# Altium schematic sheet 0111_AUDIO - COMBO JACK.SchDoc
size 848 x 558 mm
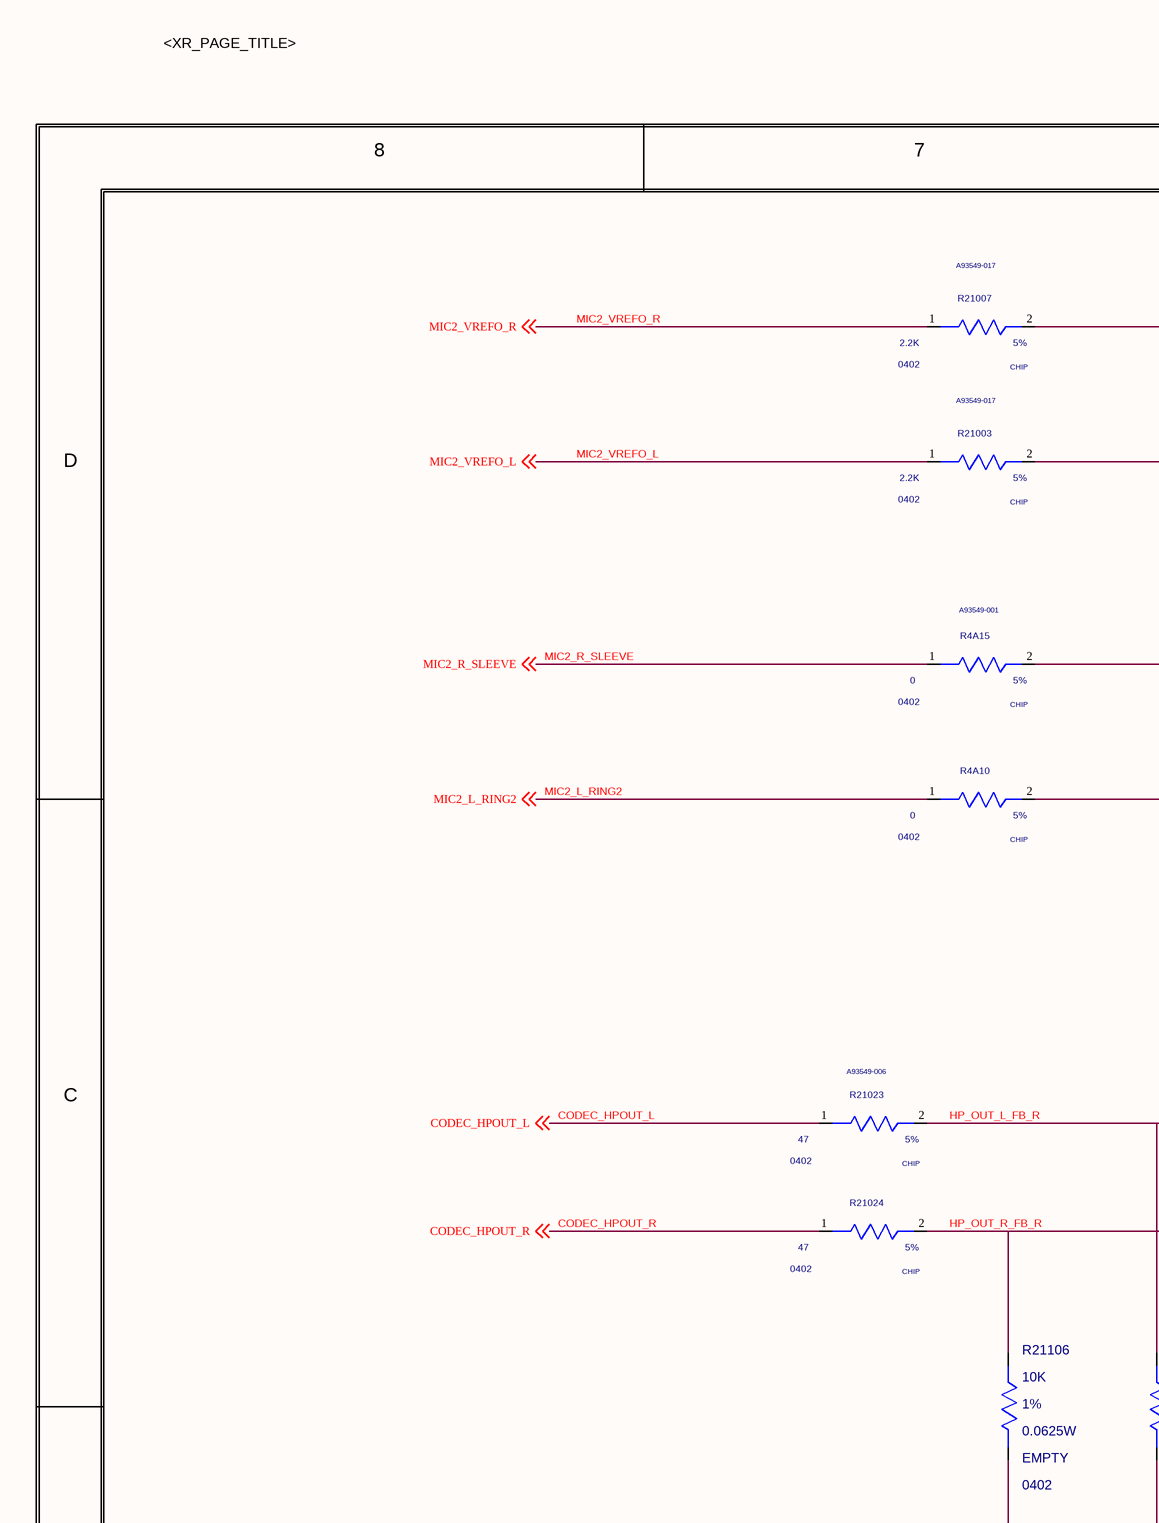
[diagram p0: 0111_AUDIO - COMBO JACK.SchDoc, top left]
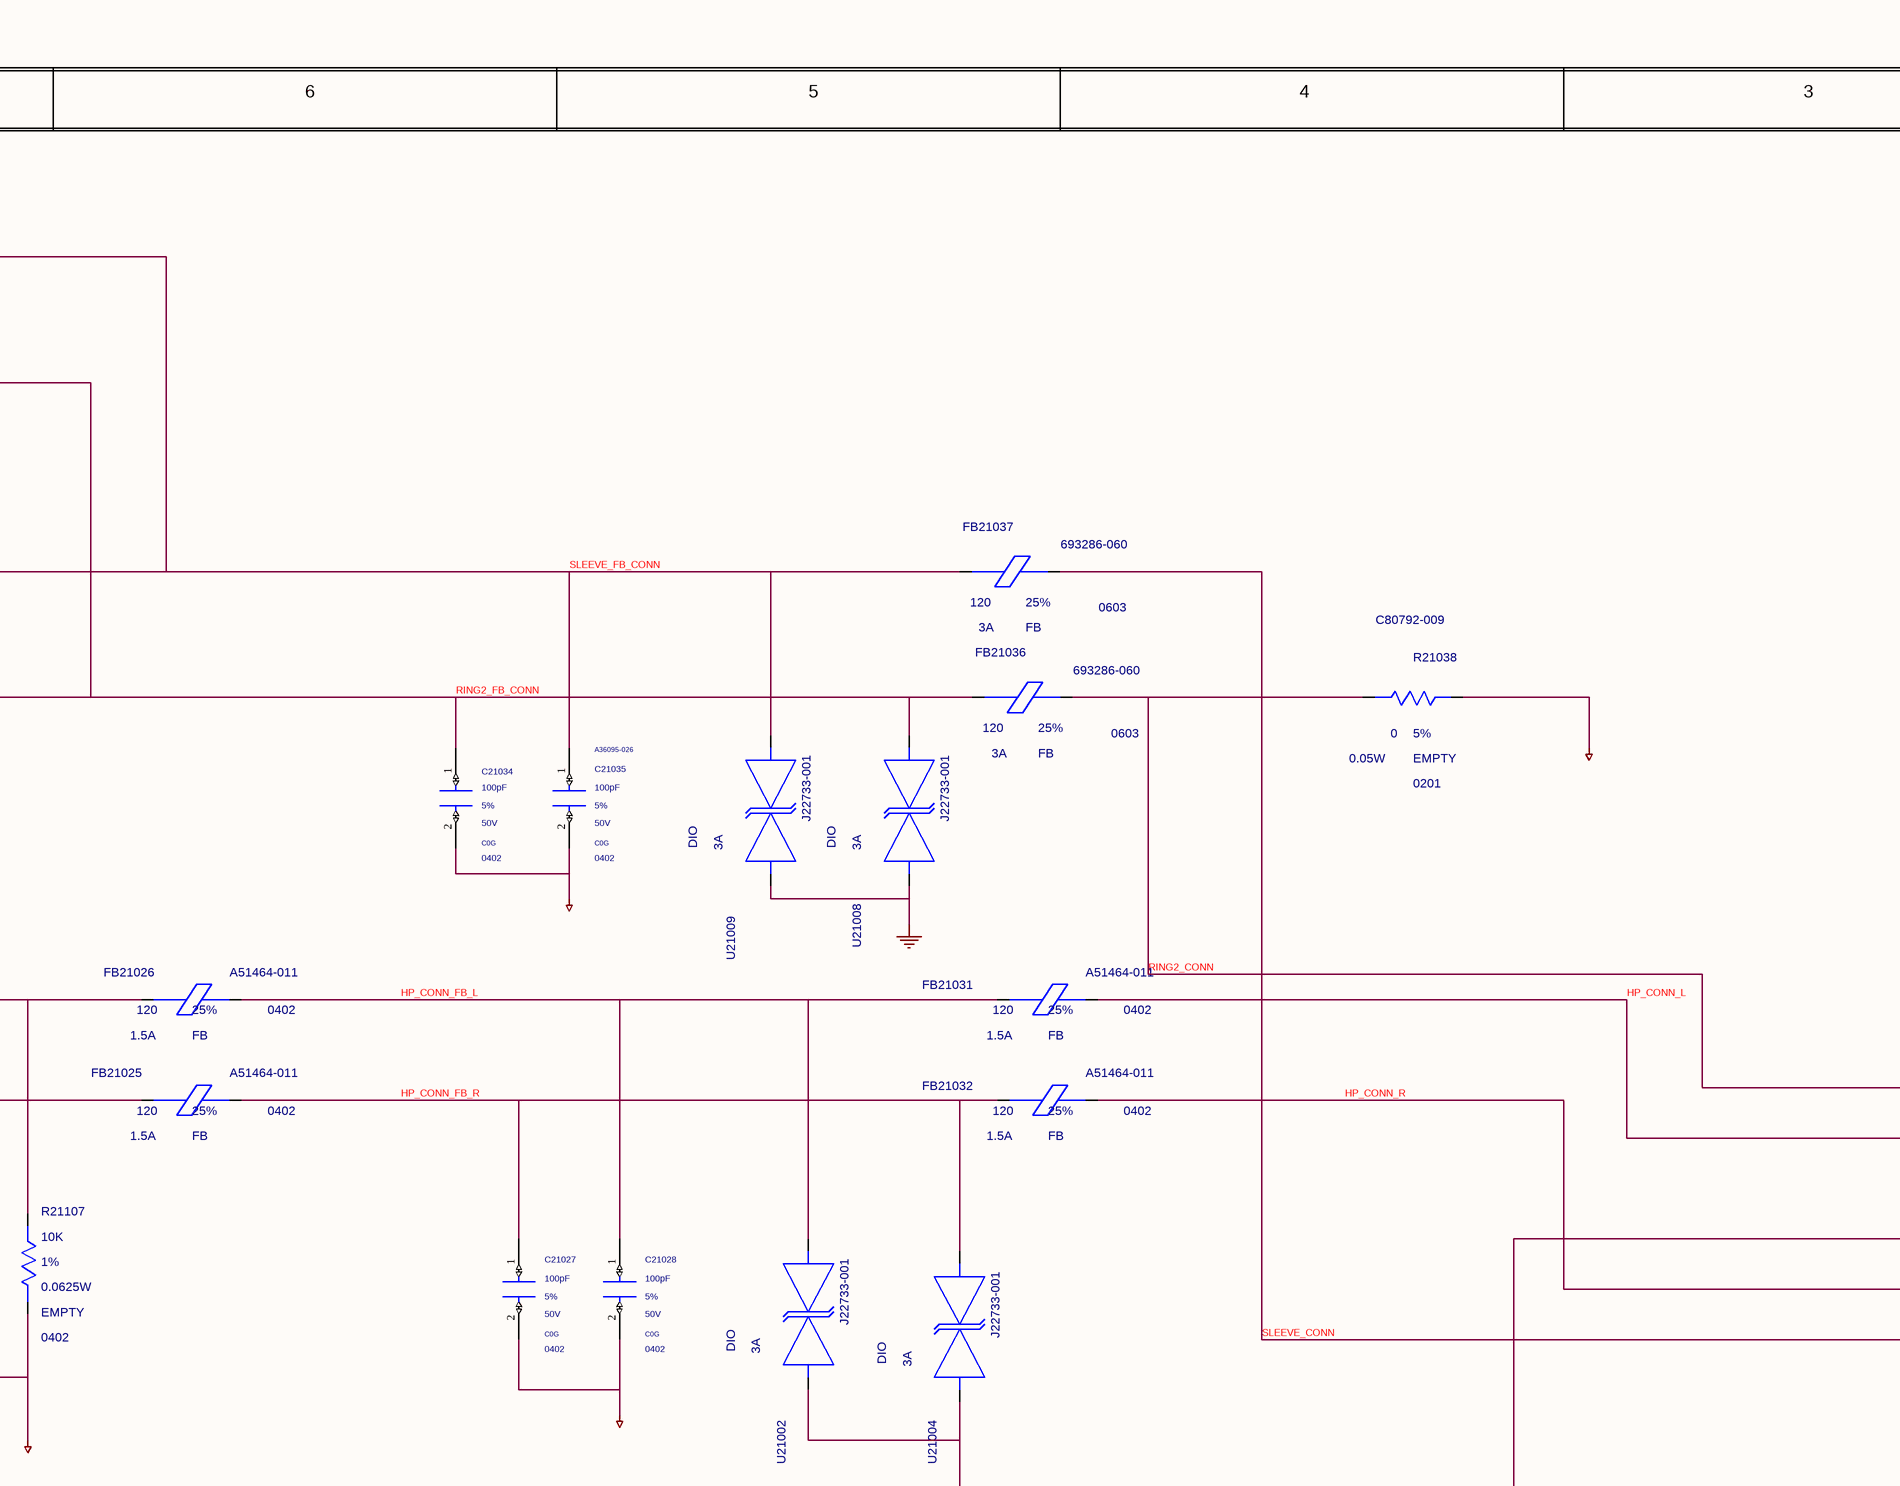
[diagram p1: 0111_AUDIO - COMBO JACK.SchDoc, top middle]
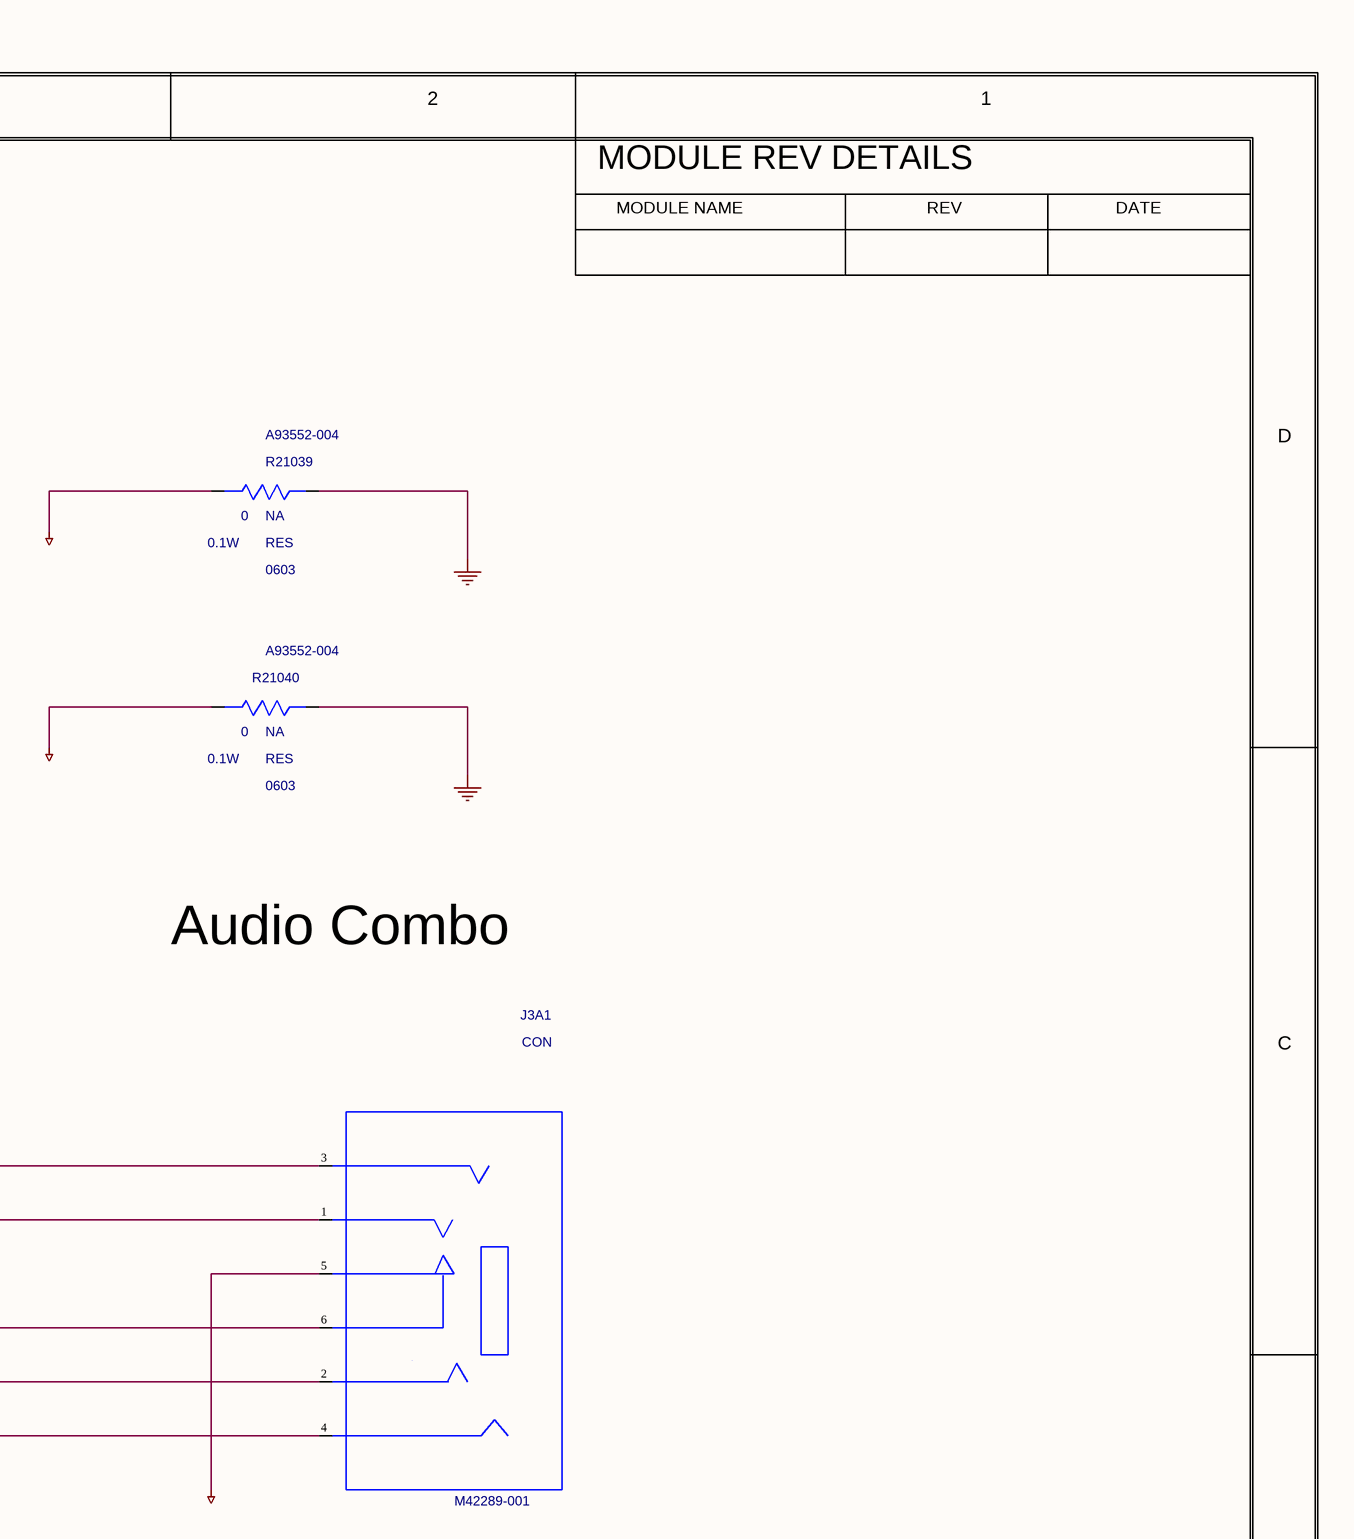
[diagram p2: 0111_AUDIO - COMBO JACK.SchDoc, top right]
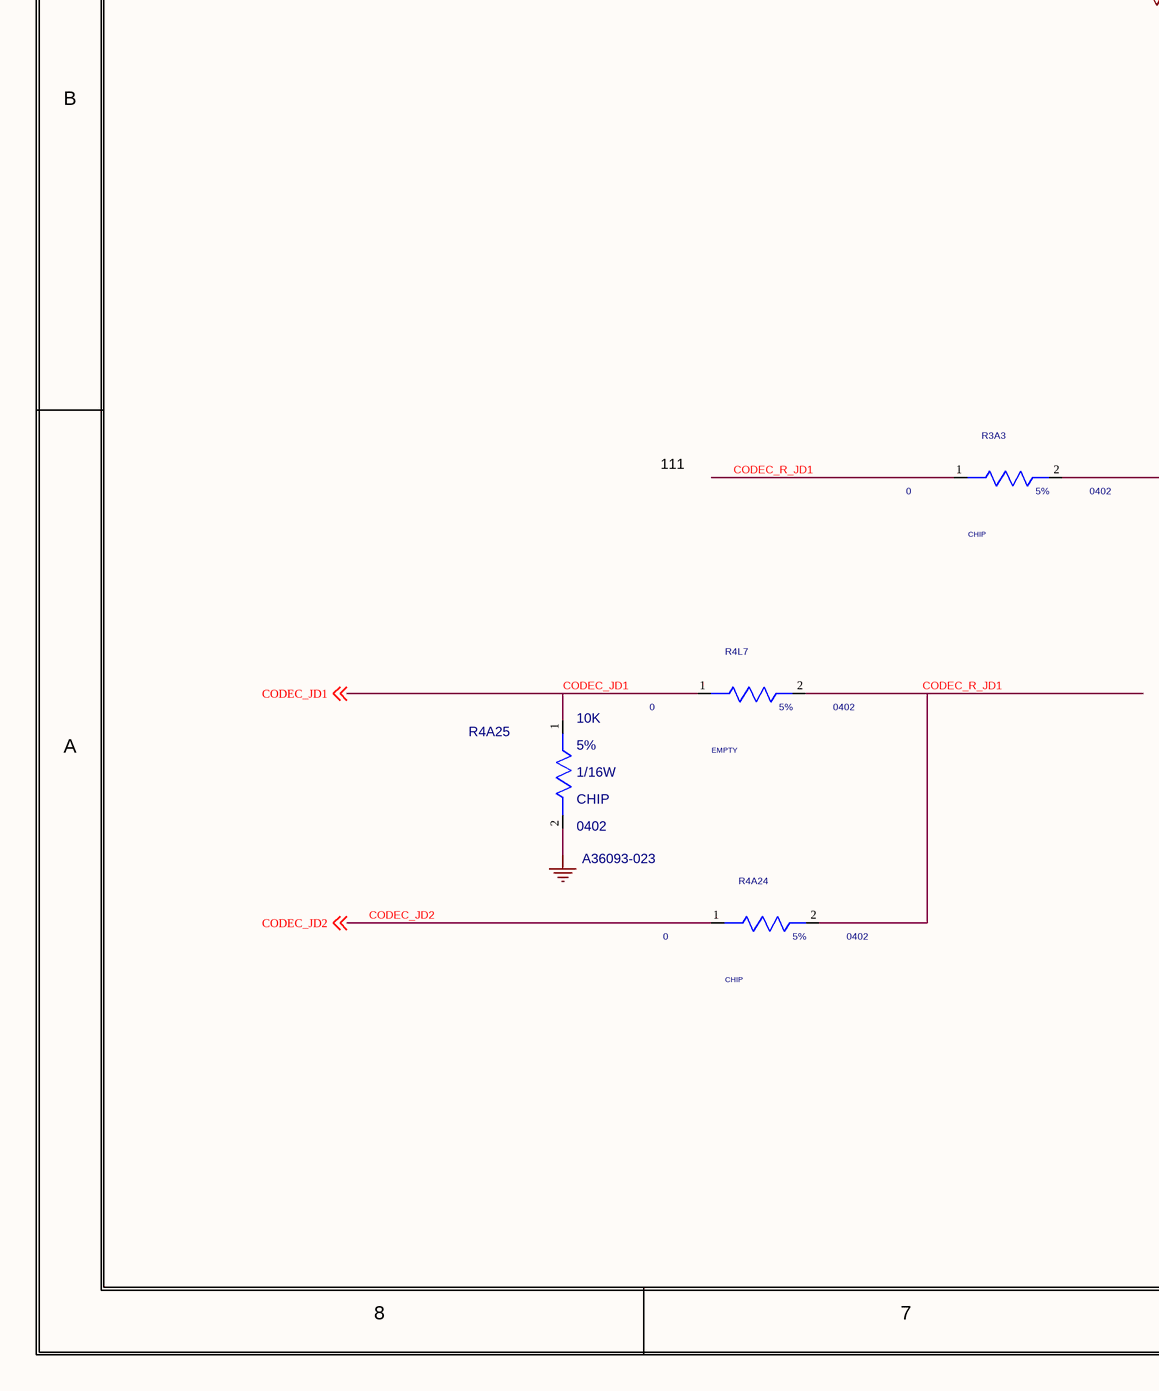
[diagram p3: 0111_AUDIO - COMBO JACK.SchDoc, bottom left]
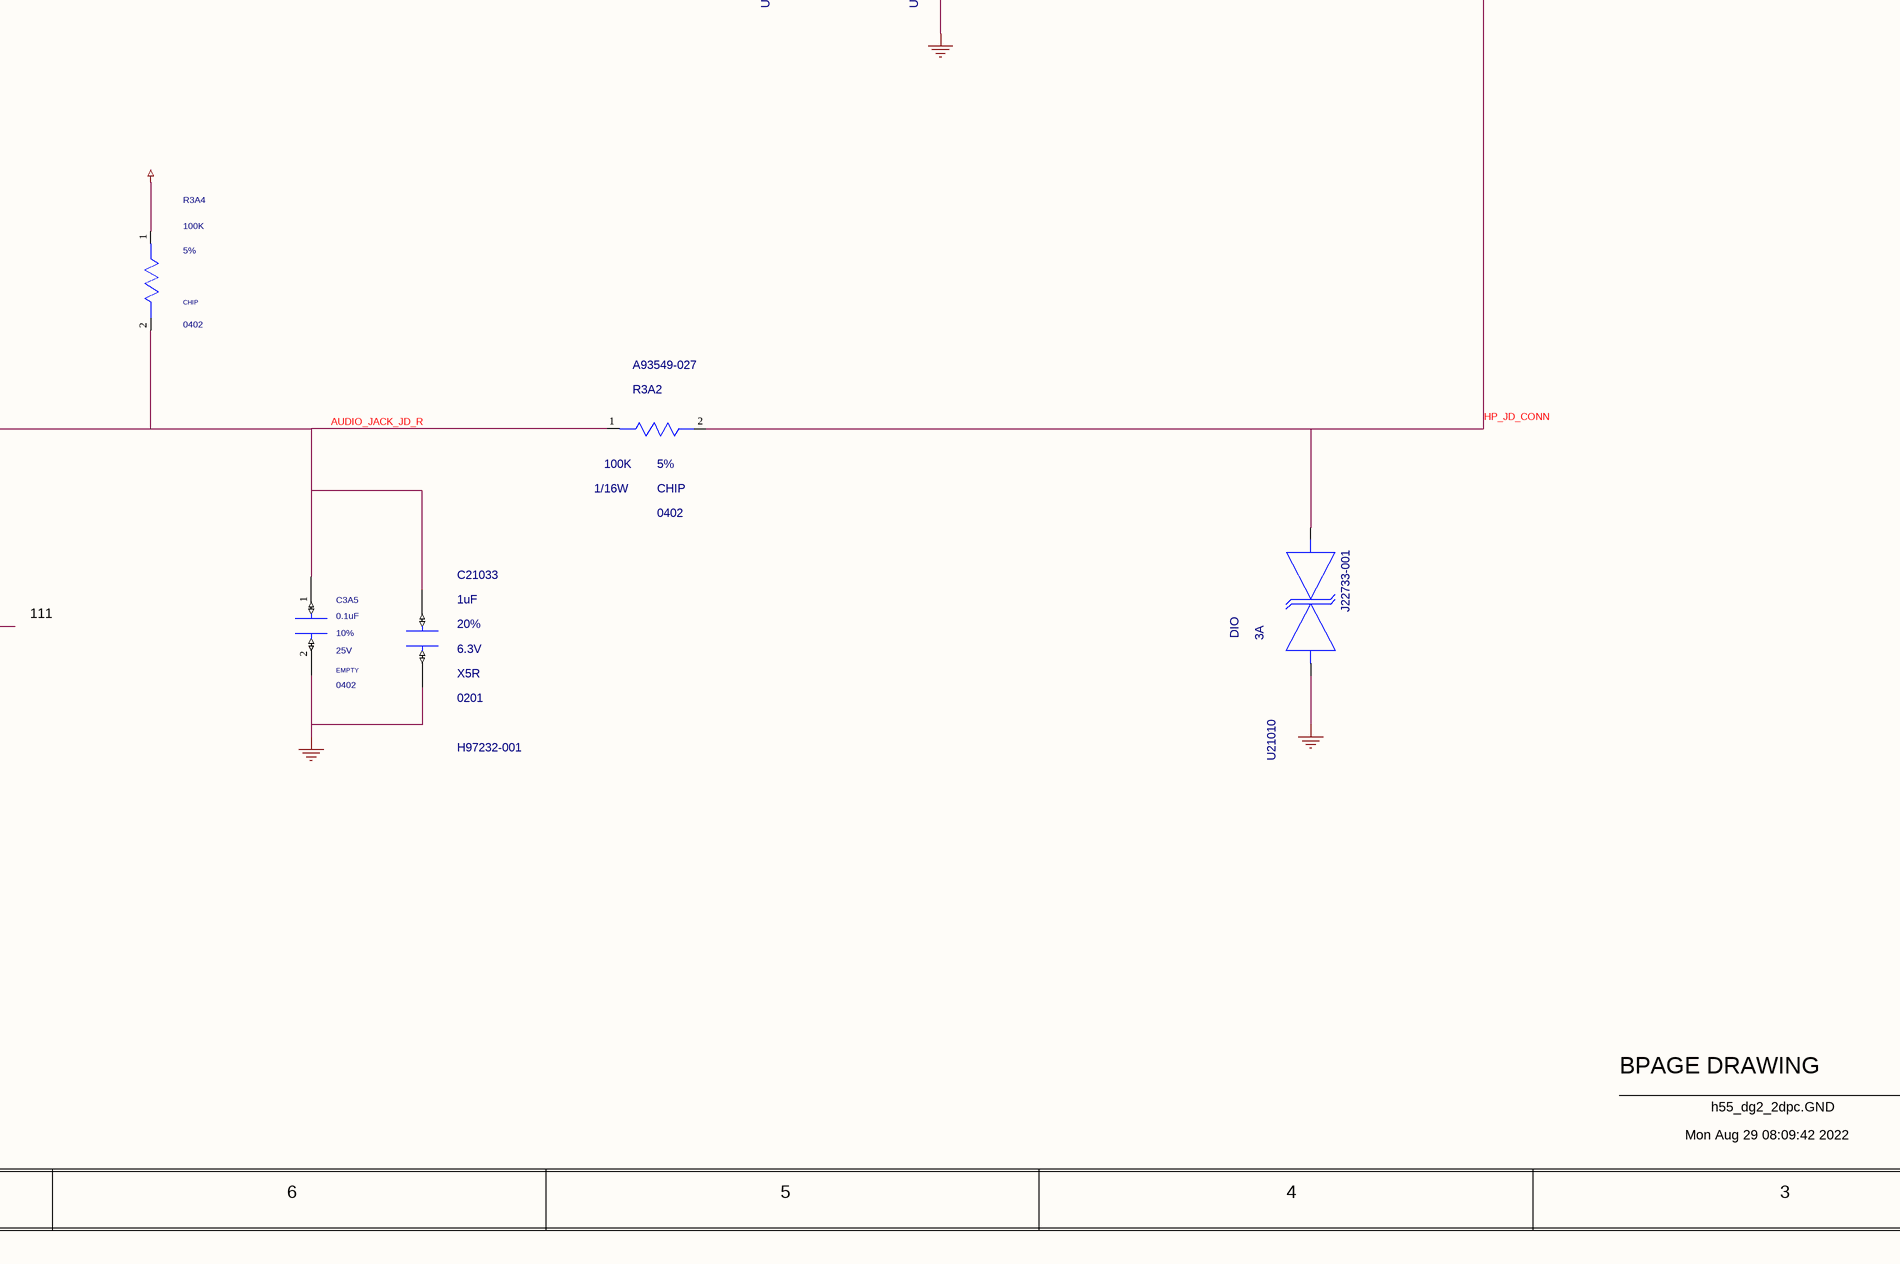
[diagram p4: 0111_AUDIO - COMBO JACK.SchDoc, bottom middle]
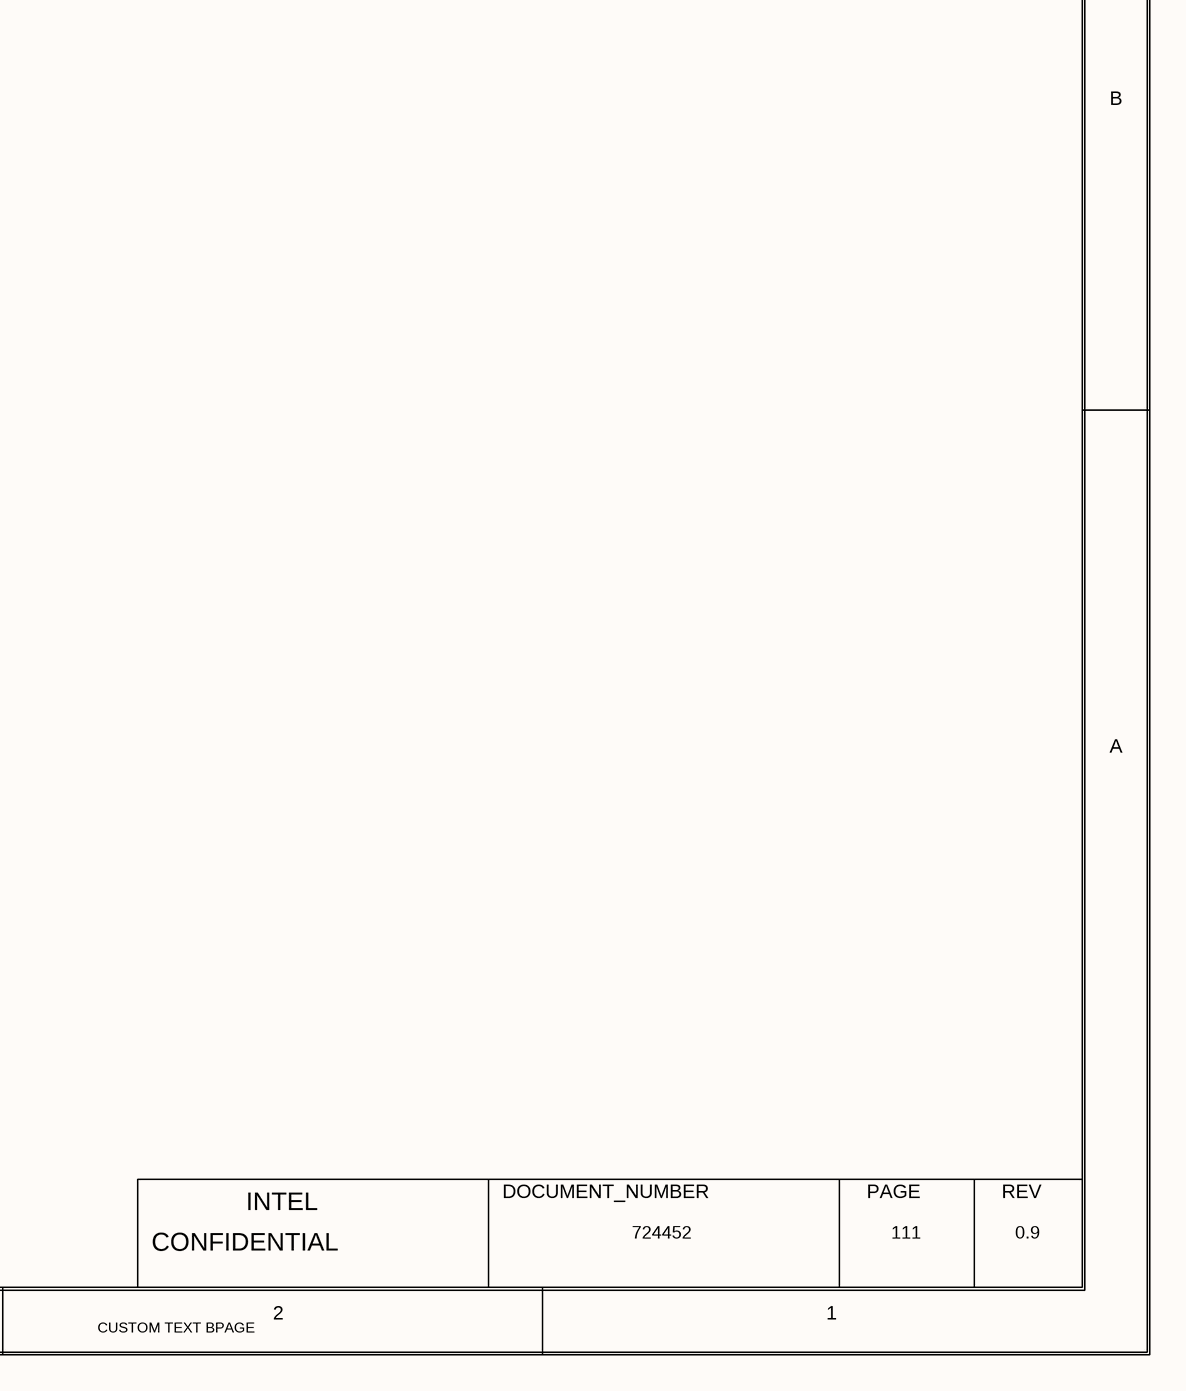
[diagram p5: 0111_AUDIO - COMBO JACK.SchDoc, bottom right]

## Parts
C3A5  0.1uF  MATERIAL: EMPTY  PACK_TYPE: 0402  TOLERANCE: 10%  VOLTAGE: 25V  [SMC0402IA]
C21027  100pF  MATERIAL: C0G  PACK_TYPE: 0402  TOLERANCE: 5%  VOLTAGE: 50V  [SMC0402IA]
C21028  100pF  MATERIAL: C0G  PACK_TYPE: 0402  TOLERANCE: 5%  VOLTAGE: 50V  [SMC0402IA]
C21033  1uF  MATERIAL: X5R  PACK_TYPE: 0201  PART_NUMBER: H97232-001  TOLERANCE: 20%  VOLTAGE: 6.3V  [CTK0_SM0201_650X350_MA]
C21034  100pF  MATERIAL: C0G  PACK_TYPE: 0402  TOLERANCE: 5%  VOLTAGE: 50V  [SMC0402IA]
C21035  100pF  MATERIAL: C0G  PACK_TYPE: 0402  PART_NUMBER: A36095-026  TOLERANCE: 5%  VOLTAGE: 50V  [SMC0402IA]
FB21025  120  CURRENT: 1.5A  MATERIAL: FB  PACK_TYPE: 0402  PART_NUMBER: A51464-011  TOLERANCE: 25%  [CTK2_SM0402_1050X550_MA]
FB21026  120  CURRENT: 1.5A  MATERIAL: FB  PACK_TYPE: 0402  PART_NUMBER: A51464-011  TOLERANCE: 25%  [CTK2_SM0402_1050X550_MA]
FB21031  120  CURRENT: 1.5A  MATERIAL: FB  PACK_TYPE: 0402  PART_NUMBER: A51464-011  TOLERANCE: 25%  [CTK2_SM0402_1050X550_MA]
FB21032  120  CURRENT: 1.5A  MATERIAL: FB  PACK_TYPE: 0402  PART_NUMBER: A51464-011  TOLERANCE: 25%  [CTK2_SM0402_1050X550_MA]
FB21036  120  CURRENT: 3A  MATERIAL: FB  PACK_TYPE: 0603  PART_NUMBER: 693286-060  TOLERANCE: 25%  [CTK2_SM0603_1750X950_MA]
FB21037  120  CURRENT: 3A  MATERIAL: FB  PACK_TYPE: 0603  PART_NUMBER: 693286-060  TOLERANCE: 25%  [CTK2_SM0603_1750X950_MA]
J3A1  MATERIAL: CON  PART_NUMBER: M42289-001  [CAUDIO_MIDJR_6P_2350_MA_PIP_VR]  (hidden comment: C_AUDIO_6P_A)
R3A2  100K  MATERIAL: CHIP  PACK_TYPE: 0402  PART_NUMBER: A93549-027  TOLERANCE: 5%  WATTAGE: 1/16W  [SMR0402IA]
R3A3  0  MATERIAL: CHIP  PACK_TYPE: 0402  TOLERANCE: 5%  [SMR0402IA]
R3A4  100K  MATERIAL: CHIP  PACK_TYPE: 0402  TOLERANCE: 5%  [SMR0402IA]
R4A10  0  MATERIAL: CHIP  PACK_TYPE: 0402  TOLERANCE: 5%  [SMR0402IA]
R4A15  0  MATERIAL: CHIP  PACK_TYPE: 0402  PART_NUMBER: A93549-001  TOLERANCE: 5%  [SMR0402IA]
R4A24  0  MATERIAL: CHIP  PACK_TYPE: 0402  TOLERANCE: 5%  [SMR0402IA]
R4A25  10K  MATERIAL: CHIP  PACK_TYPE: 0402  PART_NUMBER: A36093-023  TOLERANCE: 5%  WATTAGE: 1/16W  [SMR0402IA]
R4L7  0  MATERIAL: EMPTY  PACK_TYPE: 0402  TOLERANCE: 5%  [SMR0402IA]
R21003  2.2K  MATERIAL: CHIP  PACK_TYPE: 0402  PART_NUMBER: A93549-017  TOLERANCE: 5%  [SMR0402IA]
R21007  2.2K  MATERIAL: CHIP  PACK_TYPE: 0402  PART_NUMBER: A93549-017  TOLERANCE: 5%  [SMR0402IA]
R21023  47  MATERIAL: CHIP  PACK_TYPE: 0402  PART_NUMBER: A93549-006  TOLERANCE: 5%  [SMR0402IA]
R21024  47  MATERIAL: CHIP  PACK_TYPE: 0402  TOLERANCE: 5%  [SMR0402IA]
R21038  0  MATERIAL: EMPTY  PACK_TYPE: 0201  PART_NUMBER: C80792-009  TOLERANCE: 5%  WATTAGE: 0.05W  [CTK2_SM0201_630X330_MA]
R21039  0  MATERIAL: RES  PACK_TYPE: 0603  PART_NUMBER: A93552-004  TOLERANCE: NA  WATTAGE: 0.1W  [CTK2_SM0603_1700X950_MA]
R21040  0  MATERIAL: RES  PACK_TYPE: 0603  PART_NUMBER: A93552-004  TOLERANCE: NA  WATTAGE: 0.1W  [CTK2_SM0603_1700X950_MA]
R21106  10K  MATERIAL: EMPTY  PACK_TYPE: 0402  TOLERANCE: 1%  WATTAGE: 0.0625W  [CTK2_SM0402_1050X550_MA]
R21107  10K  MATERIAL: EMPTY  PACK_TYPE: 0402  TOLERANCE: 1%  WATTAGE: 0.0625W  [CTK2_SM0402_1050X550_MA]
U21002  CURRENT: 3A  MATERIAL: DIO  PART_NUMBER: J22733-001  [CTK2_SCR0201_610X310_MA]  (hidden comment: ESD200-B1-CSP0201)
U21004  CURRENT: 3A  MATERIAL: DIO  PART_NUMBER: J22733-001  [CTK2_SCR0201_610X310_MA]  (hidden comment: ESD200-B1-CSP0201)
U21008  CURRENT: 3A  MATERIAL: DIO  PART_NUMBER: J22733-001  [CTK2_SCR0201_610X310_MA]  (hidden comment: ESD200-B1-CSP0201)
U21009  CURRENT: 3A  MATERIAL: DIO  PART_NUMBER: J22733-001  [CTK2_SCR0201_610X310_MA]  (hidden comment: ESD200-B1-CSP0201)
U21010  CURRENT: 3A  MATERIAL: DIO  PART_NUMBER: J22733-001  [CTK2_SCR0201_610X310_MA]  (hidden comment: ESD200-B1-CSP0201)

## Nets
+V1P8A_AUDIO: R3A4.1(A)
AUDIO_AGND: C21027.2(B) C21028.2(B) C21034.2(B) C21035.2(B) J3A1.5(GND_1) R21038.2(B) R21039.1(A) R21040.1(A) R21106.2(B) R21107.2(B)
GND: C3A5.2(B) C21033.2(B) R4A25.2(B) R21039.2(B) R21040.2(B) U21002.1(A1) U21004.1(A1) U21008.1(A1) U21009.1(A1) U21010.1(A1)
AUDIO_JACK_JD_R: C3A5.1(A) C21033.1(A) R3A2.1(A) R3A3.2(B) R3A4.2(B)
CODEC_HPOUT_L: R21023.1(A) ; off-sheet CODEC_HPOUT_L
CODEC_HPOUT_R: R21024.1(A) ; off-sheet CODEC_HPOUT_R
CODEC_JD1: R4A25.1(A) R4L7.1(A) ; off-sheet CODEC_JD1
CODEC_JD2: R4A24.1(A) ; off-sheet CODEC_JD2
CODEC_R_JD1: R3A3.1(A) R4A24.2(B) R4L7.2(B)
HP_CONN_FB_L: C21028.1(A) FB21026.2(B) FB21031.1(A) U21002.2(A2)
HP_CONN_FB_R: C21027.1(A) FB21025.2(B) FB21032.1(A) U21004.2(A2)
HP_CONN_L: FB21031.2(B) J3A1.1(L_R)
HP_CONN_R: FB21032.2(B) J3A1.2(R_L)
HP_JD_CONN: J3A1.6(GND_2) R3A2.2(B) U21010.2(A2)
HP_OUT_L_FB_R: FB21026.1(A) R21023.2(B) R21107.1(A)
HP_OUT_R_FB_R: FB21025.1(A) R21024.2(B) R21106.1(A)
MIC2_L_RING2: R4A10.1(A) ; off-sheet MIC2_L_RING2
MIC2_R_SLEEVE: R4A15.1(A) ; off-sheet MIC2_R_SLEEVE
MIC2_VREFO_L: R21003.1(A) ; off-sheet MIC2_VREFO_L
MIC2_VREFO_R: R21007.1(A) ; off-sheet MIC2_VREFO_R
RING2_CONN: FB21036.2(B) J3A1.3(G_M) R21038.1(A)
RING2_FB_CONN: C21034.1(A) FB21036.1(A) R4A10.2(B) R21003.2(B) U21008.2(A2)
SLEEVE_CONN: FB21037.2(B) J3A1.4(M_G)
SLEEVE_FB_CONN: C21035.1(A) FB21037.1(A) R4A15.2(B) R21007.2(B) U21009.2(A2)

## Notes on the sheet
- <XR_PAGE_TITLE>
- 8
- 7
- 6
- 5
- 4
- 3
- 2
- 1
- MODULE REV DETAILS
- MODULE NAME
- REV
- DATE
- D
- Audio Combo
- C
- B
- 111
- A
- BPAGE DRAWING
- INTEL
- DOCUMENT_NUMBER
- PAGE
- Mon Aug 29 08:09:42 2022
- h55_dg2_2dpc.GND
- CONFIDENTIAL
- 724452
- 0.9
- CUSTOM TEXT BPAGE

## Library data of the parts
C3A5 = CAP: PART_NUMBER: A36096-112; CDS_PHYS_PART_NAME: CAP_0402-A36096-112,EMPTY,0.1UF,25V,10%,LPDB,GENERIC; OriginalSymbolOrigin: (-50,25); XY: (2500,1150); VER: 1; ROT: 0; PHYS_PAGE: 111; LOCATION: C3A5; IP: GENERIC; FP_TECH: LPDB; DRAWING: @RVP1_ADL_SB_ADP_S_DDR5_SODIMM_2DPC_LIB.H55_DG2_2DPC(SCH_1):PAGE482; CDS_LIB: discrete; PCB Footprint: SMC0402IA; CHIPS_PART_NAME: CAP; CDS_PART_NAME: CAP_0402-A36096-112,EMPTY,0.1UF,25V,10%,LPDB,GENERIC; CDS_LOCATION: C3A5; ASI_MODEL: A36096-112
C21027 = CAP: PART_NUMBER: A36095-026; CDS_PHYS_PART_NAME: CAP_0402-A36095-026,C0G,100PF,50V,5%,LPDB,GENERIC; OriginalSymbolOrigin: (-50,25); XY: (2900,2750); VER: 1; ROT: 0; PHYS_PAGE: 111; LOCATION: C21027; IP: GENERIC; FP_TECH: LPDB; DRAWING: @RVP1_ADL_SB_ADP_S_DDR5_SODIMM_2DPC_LIB.H55_DG2_2DPC(SCH_1):PAGE482; CDS_LIB: discrete; PCB Footprint: SMC0402IA; CHIPS_PART_NAME: CAP; CDS_PART_NAME: CAP_0402-A36095-026,C0G,100PF,50V,5%,LPDB,GENERIC; CDS_LOCATION: C21027; ASI_MODEL: A36095-026
C21028 = CAP: PART_NUMBER: A36095-026; CDS_PHYS_PART_NAME: CAP_0402-A36095-026,C0G,100PF,50V,5%,LPDB,GENERIC; OriginalSymbolOrigin: (-50,25); XY: (3100,2750); VER: 1; ROT: 0; PHYS_PAGE: 111; LOCATION: C21028; IP: GENERIC; FP_TECH: LPDB; DRAWING: @RVP1_ADL_SB_ADP_S_DDR5_SODIMM_2DPC_LIB.H55_DG2_2DPC(SCH_1):PAGE482; CDS_LIB: discrete; PCB Footprint: SMC0402IA; CHIPS_PART_NAME: CAP; CDS_PART_NAME: CAP_0402-A36095-026,C0G,100PF,50V,5%,LPDB,GENERIC; CDS_LOCATION: C21028; ASI_MODEL: A36095-026
C21033 = C_CAP: CDS_PHYS_PART_NAME: C_CAP_0201-H97232-001,X5R,1UF,6.3V,20%,TK0,GENERIC; CDS_LMAN_SYM_OUTLINE: -50,50,50,-50; FP_TECH: TK0; IP: GENERIC; ROOM: NONE; OriginalSymbolOrigin: (-50,25); XY: (2725,1125); VER: 1; ROT: 0; PHYS_PAGE: 111; LOCATION: C21033; DRAWING: @RVP1_ADL_SB_ADP_S_DDR5_SODIMM_2DPC_LIB.H55_DG2_2DPC(SCH_1):PAGE482; CDS_LIB: c_discrete; VARIANT: ?; PCB Footprint: CTK0_SM0201_650X350_MA; CHIPS_PART_NAME: C_CAP; CDS_PART_NAME: C_CAP_0201-H97232-001,X5R,1UF,6.3V,20%,TK0,GENERIC; CDS_LOCATION: C21033
C21034 = CAP: PART_NUMBER: A36095-026; CDS_PHYS_PART_NAME: CAP_0402-A36095-026,C0G,100PF,50V,5%,LPDB,GENERIC; OriginalSymbolOrigin: (-50,25); XY: (2775,3725); VER: 1; ROT: 0; PHYS_PAGE: 111; LOCATION: C21034; IP: GENERIC; FP_TECH: LPDB; DRAWING: @RVP1_ADL_SB_ADP_S_DDR5_SODIMM_2DPC_LIB.H55_DG2_2DPC(SCH_1):PAGE482; CDS_LIB: discrete; PCB Footprint: SMC0402IA; CHIPS_PART_NAME: CAP; CDS_PART_NAME: CAP_0402-A36095-026,C0G,100PF,50V,5%,LPDB,GENERIC; CDS_LOCATION: C21034; ASI_MODEL: A36095-026
C21035 = CAP: CDS_PHYS_PART_NAME: CAP_0402-A36095-026,C0G,100PF,50V,5%,LPDB,GENERIC; OriginalSymbolOrigin: (-50,25); XY: (3000,3725); VER: 1; ROT: 0; PHYS_PAGE: 111; LOCATION: C21035; IP: GENERIC; FP_TECH: LPDB; DRAWING: @RVP1_ADL_SB_ADP_S_DDR5_SODIMM_2DPC_LIB.H55_DG2_2DPC(SCH_1):PAGE482; CDS_LIB: discrete; PCB Footprint: SMC0402IA; CHIPS_PART_NAME: CAP; CDS_PART_NAME: CAP_0402-A36095-026,C0G,100PF,50V,5%,LPDB,GENERIC; CDS_LOCATION: C21035; ASI_MODEL: A36095-026
FB21025 = C_FERRITE: CDS_PHYS_PART_NAME: C_FERRITE_0402-A51464-011,FB,120,25%,1.5A,TK2,GENERIC; CDS_LMAN_SYM_OUTLINE: -50,50,50,-50; FP_TECH: TK2; IP: GENERIC; ROOM: NONE; OriginalSymbolOrigin: (-75,50); XY: (2250,3125); VER: 1; ROT: 0; PHYS_PAGE: 111; LOCATION: FB21025; DRAWING: @RVP1_ADL_SB_ADP_S_DDR5_SODIMM_2DPC_LIB.H55_DG2_2DPC(SCH_1):PAGE482; CDS_LIB: c_discrete; VARIANT: ?; PCB Footprint: CTK2_SM0402_1050X550_MA; CHIPS_PART_NAME: C_FERRITE; CDS_PART_NAME: C_FERRITE_0402-A51464-011,FB,120,25%,1.5A,TK2,GENERIC; CDS_LOCATION: FB21025
FB21026 = C_FERRITE: CDS_PHYS_PART_NAME: C_FERRITE_0402-A51464-011,FB,120,25%,1.5A,TK2,GENERIC; CDS_LMAN_SYM_OUTLINE: -50,50,50,-50; FP_TECH: TK2; IP: GENERIC; ROOM: NONE; OriginalSymbolOrigin: (-75,50); XY: (2250,3325); VER: 1; ROT: 0; PHYS_PAGE: 111; LOCATION: FB21026; DRAWING: @RVP1_ADL_SB_ADP_S_DDR5_SODIMM_2DPC_LIB.H55_DG2_2DPC(SCH_1):PAGE482; CDS_LIB: c_discrete; VARIANT: ?; PCB Footprint: CTK2_SM0402_1050X550_MA; CHIPS_PART_NAME: C_FERRITE; CDS_PART_NAME: C_FERRITE_0402-A51464-011,FB,120,25%,1.5A,TK2,GENERIC; CDS_LOCATION: FB21026
FB21031 = C_FERRITE: CDS_PHYS_PART_NAME: C_FERRITE_0402-A51464-011,FB,120,25%,1.5A,TK2,GENERIC; CDS_LMAN_SYM_OUTLINE: -50,50,50,-50; FP_TECH: TK2; IP: GENERIC; ROOM: NONE; OriginalSymbolOrigin: (-75,50); XY: (3950,3325); VER: 1; ROT: 0; PHYS_PAGE: 111; LOCATION: FB21031; DRAWING: @RVP1_ADL_SB_ADP_S_DDR5_SODIMM_2DPC_LIB.H55_DG2_2DPC(SCH_1):PAGE482; CDS_LIB: c_discrete; VARIANT: ?; PCB Footprint: CTK2_SM0402_1050X550_MA; CHIPS_PART_NAME: C_FERRITE; CDS_PART_NAME: C_FERRITE_0402-A51464-011,FB,120,25%,1.5A,TK2,GENERIC; CDS_LOCATION: FB21031
FB21032 = C_FERRITE: CDS_PHYS_PART_NAME: C_FERRITE_0402-A51464-011,FB,120,25%,1.5A,TK2,GENERIC; CDS_LMAN_SYM_OUTLINE: -50,50,50,-50; FP_TECH: TK2; IP: GENERIC; ROOM: NONE; OriginalSymbolOrigin: (-75,50); XY: (3950,3125); VER: 1; ROT: 0; PHYS_PAGE: 111; LOCATION: FB21032; DRAWING: @RVP1_ADL_SB_ADP_S_DDR5_SODIMM_2DPC_LIB.H55_DG2_2DPC(SCH_1):PAGE482; CDS_LIB: c_discrete; VARIANT: ?; PCB Footprint: CTK2_SM0402_1050X550_MA; CHIPS_PART_NAME: C_FERRITE; CDS_PART_NAME: C_FERRITE_0402-A51464-011,FB,120,25%,1.5A,TK2,GENERIC; CDS_LOCATION: FB21032
FB21036 = C_FERRITE: CDS_PHYS_PART_NAME: C_FERRITE_0603-693286-060,FB,120,25%,3A,TK2,GENERIC; CDS_LMAN_SYM_OUTLINE: -50,50,50,-50; FP_TECH: TK2; IP: GENERIC; ROOM: NONE; OriginalSymbolOrigin: (-75,50); XY: (3900,3925); VER: 1; ROT: 0; PHYS_PAGE: 111; LOCATION: FB21036; DRAWING: @RVP1_ADL_SB_ADP_S_DDR5_SODIMM_2DPC_LIB.H55_DG2_2DPC(SCH_1):PAGE482; CDS_LIB: c_discrete; VARIANT: ?; PCB Footprint: CTK2_SM0603_1750X950_MA; CHIPS_PART_NAME: C_FERRITE; CDS_PART_NAME: C_FERRITE_0603-693286-060,FB,120,25%,3A,TK2,GENERIC; CDS_LOCATION: FB21036
FB21037 = C_FERRITE: CDS_PHYS_PART_NAME: C_FERRITE_0603-693286-060,FB,120,25%,3A,TK2,GENERIC; CDS_LMAN_SYM_OUTLINE: -50,50,50,-50; FP_TECH: TK2; IP: GENERIC; ROOM: NONE; OriginalSymbolOrigin: (-75,50); XY: (3875,4175); VER: 1; ROT: 0; PHYS_PAGE: 111; LOCATION: FB21037; DRAWING: @RVP1_ADL_SB_ADP_S_DDR5_SODIMM_2DPC_LIB.H55_DG2_2DPC(SCH_1):PAGE482; CDS_LIB: c_discrete; VARIANT: ?; PCB Footprint: CTK2_SM0603_1750X950_MA; CHIPS_PART_NAME: C_FERRITE; CDS_PART_NAME: C_FERRITE_0603-693286-060,FB,120,25%,3A,TK2,GENERIC; CDS_LOCATION: FB21037
J3A1 = C_AUDIO_6P_A: CDS_PHYS_PART_NAME: C_AUDIO_6P_A_TH-M42289-001,CON,AUDIO_JACK_6P,TK0,GENERIC; CDS_LMAN_SYM_OUTLINE: -200,350,200,-350; FP_TECH: TK0; IP: GENERIC; PACK_TYPE: TH; ROOM: NONE; OriginalSymbolOrigin: (-200,350); XY: (6500,2900); VER: 1; ROT: 2; PHYS_PAGE: 111; LOCATION: J3A1; DRAWING: @RVP1_ADL_SB_ADP_S_DDR5_SODIMM_2DPC_LIB.H55_DG2_2DPC(SCH_1):PAGE482; CDS_LIB: local; VARIANT: ?; PCB Footprint: CAUDIO_MIDJR_6P_2350_MA_PIP_VR; SEC_TYPE: TH; CHIPS_PART_NAME: C_AUDIO_6P_A; CDS_PART_NAME: C_AUDIO_6P_A_TH-M42289-001,CON,AUDIO_JACK_6P,TK0,GENERIC; CDS_LOCATION: J3A1
R3A2 = RES#1: CHIPS_PART_NAME: RES; CDS_PHYS_PART_NAME: RES_0402-A93549-027,CHIP,100K,5%,1/16W,LPDB,GENERIC; OriginalSymbolOrigin: (-75,25); XY: (3200,1550); VER: 1; ROT: 0; PHYS_PAGE: 111; LOCATION: R3A2; IP: GENERIC; FP_TECH: LPDB; DRAWING: @RVP1_ADL_SB_ADP_S_DDR5_SODIMM_2DPC_LIB.H55_DG2_2DPC(SCH_1):PAGE482; CDS_LIB: discrete; PCB Footprint: SMR0402IA; CDS_PART_NAME: RES_0402-A93549-027,CHIP,100K,5%,1/16W,LPDB,GENERIC; CDS_LOCATION: R3A2; ASI_MODEL: A93549-027
R3A3 = RES#1: PART_NUMBER: A93549-001; CHIPS_PART_NAME: RES; CDS_PHYS_PART_NAME: RES_0402-A93549-001,CHIP,0,5%,1/16W,LPDB,GENERIC; WATTAGE: 1/16W; OriginalSymbolOrigin: (-75,25); XY: (1650,1550); VER: 1; PHYS_PAGE: 111; LOCATION: R3A3; IP: GENERIC; FP_TECH: LPDB; DRAWING: @RVP1_ADL_SB_ADP_S_DDR5_SODIMM_2DPC_LIB.H55_DG2_2DPC(SCH_1):PAGE482; CDS_LIB: discrete; PCB Footprint: SMR0402IA; ROT: 0; CDS_PART_NAME: RES_0402-A93549-001,CHIP,0,5%,1/16W,LPDB,GENERIC; CDS_LOCATION: R3A3; ASI_MODEL: A93549-001
R3A4 = RES: PART_NUMBER: A93549-027; CDS_PHYS_PART_NAME: RES_0402-A93549-027,CHIP,100K,5%,1/16W,LPDB,GENERIC; WATTAGE: 1/16W; OriginalSymbolOrigin: (-25,75); XY: (2175,1850); VER: 2; ROT: 0; PHYS_PAGE: 111; LOCATION: R3A4; IP: GENERIC; FP_TECH: LPDB; DRAWING: @RVP1_ADL_SB_ADP_S_DDR5_SODIMM_2DPC_LIB.H55_DG2_2DPC(SCH_1):PAGE482; CDS_LIB: discrete; PCB Footprint: SMR0402IA; SEC_TYPE: 0402; CHIPS_PART_NAME: RES; CDS_PART_NAME: RES_0402-A93549-027,CHIP,100K,5%,1/16W,LPDB,GENERIC; CDS_LOCATION: R3A4; ASI_MODEL: A93549-027
R4A10 = RES#1: PART_NUMBER: A93549-001; CHIPS_PART_NAME: RES; CDS_PHYS_PART_NAME: RES_0402-A93549-001,CHIP,0,5%,1/16W,LPDB,GENERIC; WATTAGE: 1/16W; OriginalSymbolOrigin: (-75,25); XY: (1600,3925); VER: 1; PHYS_PAGE: 111; LOCATION: R4A10; IP: GENERIC; FP_TECH: LPDB; DRAWING: @RVP1_ADL_SB_ADP_S_DDR5_SODIMM_2DPC_LIB.H55_DG2_2DPC(SCH_1):PAGE482; CDS_LIB: discrete; PCB Footprint: SMR0402IA; ROT: 0; CDS_PART_NAME: RES_0402-A93549-001,CHIP,0,5%,1/16W,LPDB,GENERIC; CDS_LOCATION: R4A10; ASI_MODEL: A93549-001
R4A15 = RES#1: CHIPS_PART_NAME: RES; CDS_PHYS_PART_NAME: RES_0402-A93549-001,CHIP,0,5%,1/16W,LPDB,GENERIC; WATTAGE: 1/16W; OriginalSymbolOrigin: (-75,25); XY: (1600,4175); VER: 1; PHYS_PAGE: 111; LOCATION: R4A15; IP: GENERIC; FP_TECH: LPDB; DRAWING: @RVP1_ADL_SB_ADP_S_DDR5_SODIMM_2DPC_LIB.H55_DG2_2DPC(SCH_1):PAGE482; CDS_LIB: discrete; PCB Footprint: SMR0402IA; ROT: 0; CDS_PART_NAME: RES_0402-A93549-001,CHIP,0,5%,1/16W,LPDB,GENERIC; CDS_LOCATION: R4A15; ASI_MODEL: A93549-001
R4A24 = RES#1: PART_NUMBER: A93549-001; CHIPS_PART_NAME: RES; CDS_PHYS_PART_NAME: RES_0402-A93549-001,CHIP,0,5%,1/16W,LPDB,GENERIC; WATTAGE: 1/16W; OriginalSymbolOrigin: (-75,25); XY: (1200,725); VER: 1; PHYS_PAGE: 111; LOCATION: R4A24; IP: GENERIC; FP_TECH: LPDB; DRAWING: @RVP1_ADL_SB_ADP_S_DDR5_SODIMM_2DPC_LIB.H55_DG2_2DPC(SCH_1):PAGE482; CDS_LIB: discrete; PCB Footprint: SMR0402IA; ROT: 0; CDS_PART_NAME: RES_0402-A93549-001,CHIP,0,5%,1/16W,LPDB,GENERIC; CDS_LOCATION: R4A24; ASI_MODEL: A93549-001
R4A25 = RES: CDS_PHYS_PART_NAME: RES_0402-A36093-023,CHIP,10K,5%,1/16W,LPDB,GENERIC; OriginalSymbolOrigin: (-25,75); XY: (825,1000); VER: 2; ROT: 0; PHYS_PAGE: 111; LOCATION: R4A25; IP: GENERIC; FP_TECH: LPDB; DRAWING: @RVP1_ADL_SB_ADP_S_DDR5_SODIMM_2DPC_LIB.H55_DG2_2DPC(SCH_1):PAGE482; CDS_LIB: discrete; PCB Footprint: SMR0402IA; CHIPS_PART_NAME: RES; CDS_PART_NAME: RES_0402-A36093-023,CHIP,10K,5%,1/16W,LPDB,GENERIC; CDS_LOCATION: R4A25
R4L7 = RES#1: PART_NUMBER: A93549-001; CHIPS_PART_NAME: RES; CDS_PHYS_PART_NAME: RES_0402-A93549-001,EMPTY,0,5%,1/16W,LPDB,GENERIC; WATTAGE: 1/16W; OriginalSymbolOrigin: (-75,25); XY: (1175,1150); VER: 1; PHYS_PAGE: 111; LOCATION: R4L7; IP: GENERIC; FP_TECH: LPDB; DRAWING: @RVP1_ADL_SB_ADP_S_DDR5_SODIMM_2DPC_LIB.H55_DG2_2DPC(SCH_1):PAGE482; CDS_LIB: discrete; PCB Footprint: SMR0402IA; ROT: 0; CDS_PART_NAME: RES_0402-A93549-001,EMPTY,0,5%,1/16W,LPDB,GENERIC; CDS_LOCATION: R4L7; ASI_MODEL: A93549-001
R21003 = RES#1: CHIPS_PART_NAME: RES; CDS_PHYS_PART_NAME: RES_0402-A93549-017,CHIP,2.2K,5%,1/16W,LPDB,GENERIC; WATTAGE: 1/16W; OriginalSymbolOrigin: (-75,25); XY: (1600,4550); VER: 1; ROT: 0; PHYS_PAGE: 111; LOCATION: R21003; IP: GENERIC; FP_TECH: LPDB; DRAWING: @RVP1_ADL_SB_ADP_S_DDR5_SODIMM_2DPC_LIB.H55_DG2_2DPC(SCH_1):PAGE482; CDS_LIB: discrete; PCB Footprint: SMR0402IA; CDS_PART_NAME: RES_0402-A93549-017,CHIP,2.2K,5%,1/16W,LPDB,GENERIC; CDS_LOCATION: R21003; ASI_MODEL: A93549-017
R21007 = RES#1: CHIPS_PART_NAME: RES; CDS_PHYS_PART_NAME: RES_0402-A93549-017,CHIP,2.2K,5%,1/16W,LPDB,GENERIC; WATTAGE: 1/16W; OriginalSymbolOrigin: (-75,25); XY: (1600,4800); VER: 1; ROT: 0; PHYS_PAGE: 111; LOCATION: R21007; IP: GENERIC; FP_TECH: LPDB; DRAWING: @RVP1_ADL_SB_ADP_S_DDR5_SODIMM_2DPC_LIB.H55_DG2_2DPC(SCH_1):PAGE482; CDS_LIB: discrete; PCB Footprint: SMR0402IA; CDS_PART_NAME: RES_0402-A93549-017,CHIP,2.2K,5%,1/16W,LPDB,GENERIC; CDS_LOCATION: R21007; ASI_MODEL: A93549-017
R21023 = RES#1: CHIPS_PART_NAME: RES; CDS_PHYS_PART_NAME: RES_0402-A93549-006,CHIP,47,5%,1/16W,LPDB,GENERIC; WATTAGE: 1/16W; OriginalSymbolOrigin: (-75,25); XY: (1400,3325); VER: 1; ROT: 0; PHYS_PAGE: 111; LOCATION: R21023; IP: GENERIC; FP_TECH: LPDB; DRAWING: @RVP1_ADL_SB_ADP_S_DDR5_SODIMM_2DPC_LIB.H55_DG2_2DPC(SCH_1):PAGE482; CDS_LIB: discrete; PCB Footprint: SMR0402IA; CDS_PART_NAME: RES_0402-A93549-006,CHIP,47,5%,1/16W,LPDB,GENERIC; CDS_LOCATION: R21023; ASI_MODEL: A93549-006
R21024 = RES#1: PART_NUMBER: A93549-006; CHIPS_PART_NAME: RES; CDS_PHYS_PART_NAME: RES_0402-A93549-006,CHIP,47,5%,1/16W,LPDB,GENERIC; WATTAGE: 1/16W; OriginalSymbolOrigin: (-75,25); XY: (1400,3125); VER: 1; ROT: 0; PHYS_PAGE: 111; LOCATION: R21024; IP: GENERIC; FP_TECH: LPDB; DRAWING: @RVP1_ADL_SB_ADP_S_DDR5_SODIMM_2DPC_LIB.H55_DG2_2DPC(SCH_1):PAGE482; CDS_LIB: discrete; PCB Footprint: SMR0402IA; CDS_PART_NAME: RES_0402-A93549-006,CHIP,47,5%,1/16W,LPDB,GENERIC; CDS_LOCATION: R21024; ASI_MODEL: A93549-006
R21038 = C_RES#1: CHIPS_PART_NAME: C_RES; CDS_PHYS_PART_NAME: C_RES_0201-C80792-009,EMPTY,0,5%,0.05W,TK2,GENERIC; CDS_LMAN_SYM_OUTLINE: -50,50,50,-50; FP_TECH: TK2; IP: GENERIC; ROOM: NONE; OriginalSymbolOrigin: (-75,25); XY: (4675,3925); VER: 1; PHYS_PAGE: 111; LOCATION: R21038; DRAWING: @RVP1_ADL_SB_ADP_S_DDR5_SODIMM_2DPC_LIB.H55_DG2_2DPC(SCH_1):PAGE482; CDS_LIB: c_discrete; VARIANT: ?; PCB Footprint: CTK2_SM0201_630X330_MA; ROT: 0; CDS_PART_NAME: C_RES_0201-C80792-009,EMPTY,0,5%,0.05W,TK2,GENERIC; CDS_LOCATION: R21038
R21039 = C_RES#1: CHIPS_PART_NAME: C_RES; CDS_PHYS_PART_NAME: C_RES_0603-A93552-004,RES,0,NA,0.1W,TK2,GENERIC; CDS_LMAN_SYM_OUTLINE: -50,50,50,-50; FP_TECH: TK2; IP: GENERIC; ROOM: NONE; OriginalSymbolOrigin: (-75,25); XY: (6150,4400); VER: 1; PHYS_PAGE: 111; LOCATION: R21039; DRAWING: @RVP1_ADL_SB_ADP_S_DDR5_SODIMM_2DPC_LIB.H55_DG2_2DPC(SCH_1):PAGE482; CDS_LIB: c_discrete; VARIANT: ?; PCB Footprint: CTK2_SM0603_1700X950_MA; ROT: 0; CDS_PART_NAME: C_RES_0603-A93552-004,RES,0,NA,0.1W,TK2,GENERIC; CDS_LOCATION: R21039
R21040 = C_RES#1: CHIPS_PART_NAME: C_RES; CDS_PHYS_PART_NAME: C_RES_0603-A93552-004,RES,0,NA,0.1W,TK2,GENERIC; CDS_LMAN_SYM_OUTLINE: -50,50,50,-50; FP_TECH: TK2; IP: GENERIC; ROOM: NONE; OriginalSymbolOrigin: (-75,25); XY: (6150,4000); VER: 1; PHYS_PAGE: 111; LOCATION: R21040; DRAWING: @RVP1_ADL_SB_ADP_S_DDR5_SODIMM_2DPC_LIB.H55_DG2_2DPC(SCH_1):PAGE482; CDS_LIB: c_discrete; VARIANT: ?; PCB Footprint: CTK2_SM0603_1700X950_MA; ROT: 0; CDS_PART_NAME: C_RES_0603-A93552-004,RES,0,NA,0.1W,TK2,GENERIC; CDS_LOCATION: R21040
R21106 = C_RES: PART_NUMBER: A93548-599; CDS_PHYS_PART_NAME: C_RES_0402-A93548-599,EMPTY,10K,1%,0.0625W,TK2,GENERIC; CDS_LMAN_SYM_OUTLINE: -50,50,50,-50; FP_TECH: TK2; IP: GENERIC; ROOM: NONE; OriginalSymbolOrigin: (-25,75); XY: (1650,2800); VER: 2; ROT: 0; PHYS_PAGE: 111; LOCATION: R21106; DRAWING: @RVP1_ADL_SB_ADP_S_DDR5_SODIMM_2DPC_LIB.H55_DG2_2DPC(SCH_1):PAGE482; CDS_LIB: c_discrete; VARIANT: ?; PCB Footprint: CTK2_SM0402_1050X550_MA; CHIPS_PART_NAME: C_RES; CDS_PART_NAME: C_RES_0402-A93548-599,EMPTY,10K,1%,0.0625W,TK2,GENERIC; CDS_LOCATION: R21106
R21107 = C_RES: PART_NUMBER: A93548-599; CDS_PHYS_PART_NAME: C_RES_0402-A93548-599,EMPTY,10K,1%,0.0625W,TK2,GENERIC; CDS_LMAN_SYM_OUTLINE: -50,50,50,-50; FP_TECH: TK2; IP: GENERIC; ROOM: NONE; OriginalSymbolOrigin: (-25,75); XY: (1925,2800); VER: 2; ROT: 0; PHYS_PAGE: 111; LOCATION: R21107; DRAWING: @RVP1_ADL_SB_ADP_S_DDR5_SODIMM_2DPC_LIB.H55_DG2_2DPC(SCH_1):PAGE482; CDS_LIB: c_discrete; VARIANT: ?; PCB Footprint: CTK2_SM0402_1050X550_MA; CHIPS_PART_NAME: C_RES; CDS_PART_NAME: C_RES_0402-A93548-599,EMPTY,10K,1%,0.0625W,TK2,GENERIC; CDS_LOCATION: R21107
U21002 = C_DIODE_TVS: CDS_PHYS_PART_NAME: C_DIODE_TVS_SM-J22733-001,DIO,ESD200-B1-CSP0201,3A,TK2,GENERIC; CDS_LMAN_SYM_OUTLINE: -100,50,100,-50; FP_TECH: TK2; IP: GENERIC; PACK_TYPE: SM; ROOM: NONE; OriginalSymbolOrigin: (-125,50); XY: (3475,2700); VER: 1; PHYS_PAGE: 111; LOCATION: U21002; DRAWING: @RVP1_ADL_SB_ADP_S_DDR5_SODIMM_2DPC_LIB.H55_DG2_2DPC(SCH_1):PAGE482; CDS_LIB: local; VARIANT: ?; PCB Footprint: CTK2_SCR0201_610X310_MA; ROT: 1; CHIPS_PART_NAME: C_DIODE_TVS; CDS_PART_NAME: C_DIODE_TVS_SM-J22733-001,DIO,ESD200-B1-CSP0201,3A,TK2,GENERIC; CDS_LOCATION: U21002
U21004 = C_DIODE_TVS: CDS_PHYS_PART_NAME: C_DIODE_TVS_SM-J22733-001,DIO,ESD200-B1-CSP0201,3A,TK2,GENERIC; CDS_LMAN_SYM_OUTLINE: -100,50,100,-50; FP_TECH: TK2; IP: GENERIC; PACK_TYPE: SM; ROOM: NONE; OriginalSymbolOrigin: (-125,50); XY: (3775,2675); VER: 1; PHYS_PAGE: 111; LOCATION: U21004; DRAWING: @RVP1_ADL_SB_ADP_S_DDR5_SODIMM_2DPC_LIB.H55_DG2_2DPC(SCH_1):PAGE482; CDS_LIB: local; VARIANT: ?; PCB Footprint: CTK2_SCR0201_610X310_MA; ROT: 1; CHIPS_PART_NAME: C_DIODE_TVS; CDS_PART_NAME: C_DIODE_TVS_SM-J22733-001,DIO,ESD200-B1-CSP0201,3A,TK2,GENERIC; CDS_LOCATION: U21004
U21008 = C_DIODE_TVS: CDS_PHYS_PART_NAME: C_DIODE_TVS_SM-J22733-001,DIO,ESD200-B1-CSP0201,3A,TK2,GENERIC; CDS_LMAN_SYM_OUTLINE: -100,50,100,-50; FP_TECH: TK2; IP: GENERIC; PACK_TYPE: SM; ROOM: NONE; OriginalSymbolOrigin: (-125,50); XY: (3675,3700); VER: 1; PHYS_PAGE: 111; LOCATION: U21008; DRAWING: @RVP1_ADL_SB_ADP_S_DDR5_SODIMM_2DPC_LIB.H55_DG2_2DPC(SCH_1):PAGE482; CDS_LIB: local; VARIANT: ?; PCB Footprint: CTK2_SCR0201_610X310_MA; ROT: 1; CHIPS_PART_NAME: C_DIODE_TVS; CDS_PART_NAME: C_DIODE_TVS_SM-J22733-001,DIO,ESD200-B1-CSP0201,3A,TK2,GENERIC; CDS_LOCATION: U21008
U21009 = C_DIODE_TVS: CDS_PHYS_PART_NAME: C_DIODE_TVS_SM-J22733-001,DIO,ESD200-B1-CSP0201,3A,TK2,GENERIC; CDS_LMAN_SYM_OUTLINE: -100,50,100,-50; FP_TECH: TK2; IP: GENERIC; PACK_TYPE: SM; ROOM: NONE; OriginalSymbolOrigin: (-125,50); XY: (3400,3700); VER: 1; PHYS_PAGE: 111; LOCATION: U21009; DRAWING: @RVP1_ADL_SB_ADP_S_DDR5_SODIMM_2DPC_LIB.H55_DG2_2DPC(SCH_1):PAGE482; CDS_LIB: local; VARIANT: ?; PCB Footprint: CTK2_SCR0201_610X310_MA; ROT: 1; CHIPS_PART_NAME: C_DIODE_TVS; CDS_PART_NAME: C_DIODE_TVS_SM-J22733-001,DIO,ESD200-B1-CSP0201,3A,TK2,GENERIC; CDS_LOCATION: U21009
U21010 = C_DIODE_TVS: CDS_PHYS_PART_NAME: C_DIODE_TVS_SM-J22733-001,DIO,ESD200-B1-CSP0201,3A,TK2,GENERIC; CDS_LMAN_SYM_OUTLINE: -100,50,100,-50; FP_TECH: TK2; IP: GENERIC; PACK_TYPE: SM; ROOM: NONE; OriginalSymbolOrigin: (-125,50); XY: (4525,1200); VER: 1; PHYS_PAGE: 111; LOCATION: U21010; DRAWING: @RVP1_ADL_SB_ADP_S_DDR5_SODIMM_2DPC_LIB.H55_DG2_2DPC(SCH_1):PAGE482; CDS_LIB: local; VARIANT: ?; PCB Footprint: CTK2_SCR0201_610X310_MA; ROT: 1; CHIPS_PART_NAME: C_DIODE_TVS; CDS_PART_NAME: C_DIODE_TVS_SM-J22733-001,DIO,ESD200-B1-CSP0201,3A,TK2,GENERIC; CDS_LOCATION: U21010